# Altium schematic sheet Power.SchDoc: Power
size A4
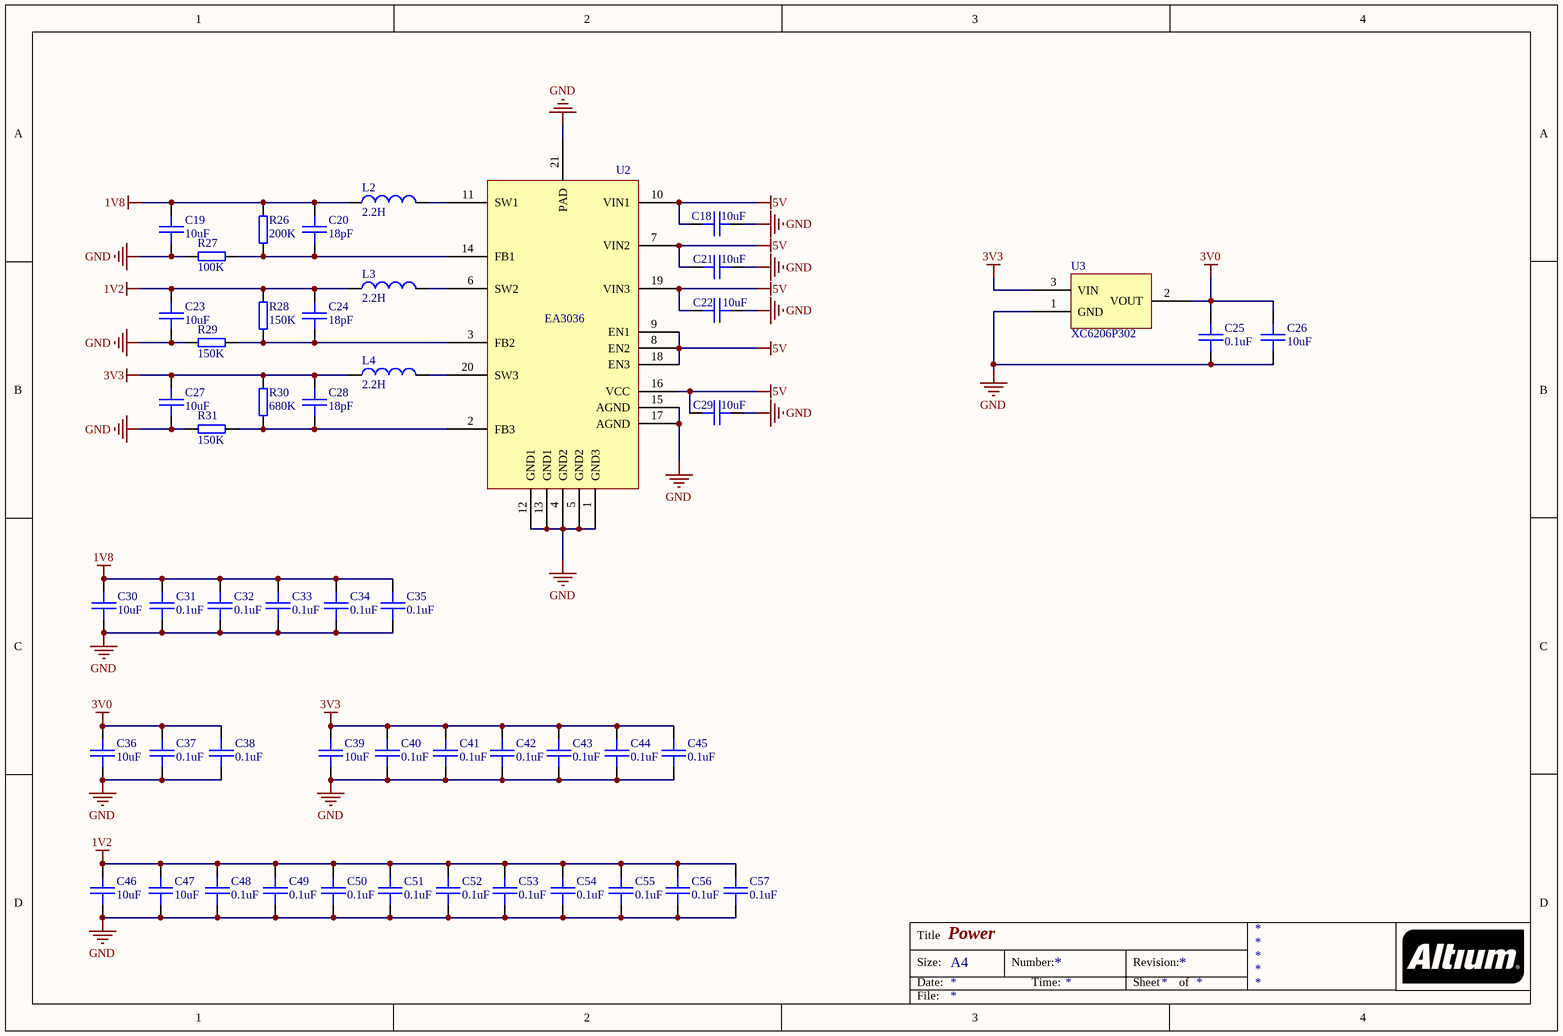
[diagram p0: Power.SchDoc]

## Parts
C18  10uF  [CAP-1206]
C19  10uF  [CAP-1206]
C20  18pF  [CAP-0603]
C21  10uF  [CAP-1206]
C22  10uF  [CAP-1206]
C23  10uF  [CAP-1206]
C24  18pF  [CAP-0603]
C25  0.1uF  [CAP-0603]
C26  10uF  [CAP-1206]
C27  10uF  [CAP-1206]
C28  18pF  [CAP-0603]
C29  10uF  [CAP-1206]
C30  10uF  [CAP-0603]
C31  0.1uF  [CAP-0603]
C32  0.1uF  [CAP-0603]
C33  0.1uF  [CAP-0603]
C34  0.1uF  [CAP-0603]
C35  0.1uF  [CAP-0603]
C36  10uF  [CAP-0603]
C37  0.1uF  [CAP-0603]
C38  0.1uF  [CAP-0603]
C39  10uF  [CAP-0603]
C40  0.1uF  [CAP-0603]
C41  0.1uF  [CAP-0603]
C42  0.1uF  [CAP-0603]
C43  0.1uF  [CAP-0603]
C44  0.1uF  [CAP-0603]
C45  0.1uF  [CAP-0603]
C46  10uF  [CAP-0603]
C47  10uF  [CAP-0603]
C48  0.1uF  [CAP-0603]
C49  0.1uF  [CAP-0603]
C50  0.1uF  [CAP-0603]
C51  0.1uF  [CAP-0603]
C52  0.1uF  [CAP-0603]
C53  0.1uF  [CAP-0603]
C54  0.1uF  [CAP-0603]
C55  0.1uF  [CAP-0603]
C56  0.1uF  [CAP-0603]
C57  0.1uF  [CAP-0603]
L2  2.2H  [L-PWR-6028]
L3  2.2H  [L-PWR-6028]
L4  2.2H  [L-PWR-6028]
R26  200K  [RES-0603]
R27  100K  [RES-0603]
R28  150K  [RES-0603]
R29  150K  [RES-0603]
R30  680K  [RES-0603]
R31  150K  [RES-0603]
U2  EA3036  [QFN20-3X3]
U3  XC6206P302  [SOT-23-3L]

## Nets
1V2: C23.2 C24.1 C46.1 C47.1 C48.1 C49.1 C50.1 C51.1 C52.1 C53.1 C54.1 C55.1 C56.1 C57.1 L3.1 R28.2
1V8: C19.2 C20.1 C30.1 C31.1 C32.1 C33.1 C34.1 C35.1 L2.1 R26.2
3V0: C25.1 C26.1 C36.1 C37.1 C38.1 U3.2(VOUT)
3V3: C27.2 C28.1 C39.1 C40.1 C41.1 C42.1 C43.1 C44.1 C45.1 L4.1 R30.2 U3.3(VIN)
5V: C18.2 C21.2 C22.2 C29.2 U2.7(VIN2) U2.8(EN2) U2.9(EN1) U2.10(VIN1) U2.16(VCC) U2.18(EN3) U2.19(VIN3)
GND: C18.1 C19.1 C21.1 C22.1 C23.1 C25.2 C26.2 C27.1 C29.1 C30.2 C31.2 C32.2 C33.2 C34.2 C35.2 C36.2 C37.2 C38.2 C39.2 C40.2 C41.2 C42.2 C43.2 C44.2 C45.2 C46.2 C47.2 C48.2 C49.2 C50.2 C51.2 C52.2 C53.2 C54.2 C55.2 C56.2 C57.2 R27.2 R29.2 R31.2 U2.1(GND3) U2.4(GND2) U2.5(GND2) U2.12(GND1) U2.13(GND1) U2.15(AGND) U2.17(AGND) U2.21(PAD) U3.1(GND)
NetC20_2: C20.2 R26.1 R27.1 U2.14(FB1)
NetC24_2: C24.2 R28.1 R29.1 U2.3(FB2)
NetC28_2: C28.2 R30.1 R31.1 U2.2(FB3)
NetL2_2: L2.2 U2.11(SW1)
NetL3_2: L3.2 U2.6(SW2)
NetL4_2: L4.2 U2.20(SW3)

## Notes on the sheet
- Title
- Size:
- Date:
- A4
- Number:
- Time:
- Revision:
- Sheet
- of
- File:

## Library data of the parts
C18 C19 C21-C23 C26 C27 C29 = C_1206: 陶瓷贴片电容1206; tolerance: 10%; voltage: 50V; C_value: 10uF
C20 C24 C25 C28 C30-C57 = C_0603: 陶瓷贴片电容0603; tolerance: 10%; voltage: 50V; ESR: 1.73mOhm; IRMS: 5.59A; Series: X7R
  C20 C24 C28: C_value: 18pF
  C25 C31-C35 C37 C38 C40-C45 C48-C57: C_value: 0.1uF
  C30 C36 C39 C46 C47: C_value: 10uF
L2-L4 = L_Power: 功率电感; DCR: 0.1Ohm; IDC: 2.7A; tolerance: 20%; L_value: 2.2H
R26-R31 = R_0603: 贴片电阻0603; tolerance: 5%; voltage: 50V; power: 0.063W
  R26: R_value: 200K
  R27: R_value: 100K
  R28 R29 R31: R_value: 150K
  R30: R_value: 680K
U2 = EA3036: 3CH Power Management IC
U3 = XC6206: XC6206 LDO=3V